# EAGLE schematic pcb (EAGLE 7.5.0)
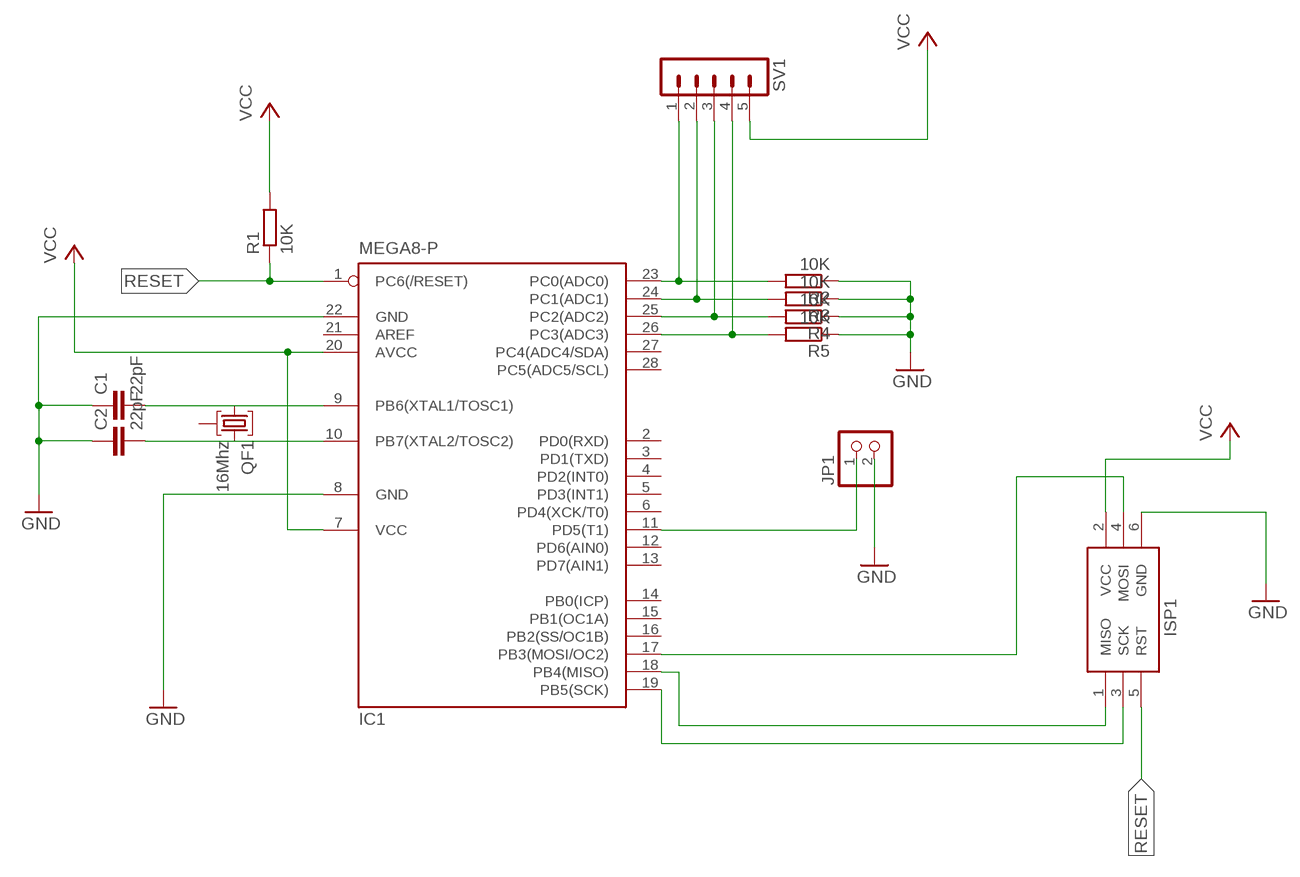
[diagram p0: schematic, sheet 1]

## Parts
C1  22pF  C-EU025-025X050  [C025-025X050]
C2  22pF  C-EU025-025X050  [C025-025X050]
IC1  MEGA8-P  [DIL28-3]
ISP1  AVRISP-6  [AVRISP]
JP1  PINHD-1X2  [1X02]
QF1  16Mhz  8M10AHC49T  [HC49U]
R1  10K  R-EU_0204/5  [0204/5]
R2  10K  R-EU_0204/5  [0204/5]
R3  10K  R-EU_0204/5  [0204/5]
R4  10K  R-EU_0204/5  [0204/5]
R5  10K  R-EU_0204/5  [0204/5]
SV1  MA05-1  [MA05-1]

## Nets
GND: C1.1 C2.1 IC1.8(GND) IC1.22(GND) ISP1.6(GND) JP1.2 R2.1 R3.1 R4.1 R5.1
N$2: IC1.26(PC3(ADC3)) R5.2 SV1.4
N$3: IC1.25(PC2(ADC2)) R4.2 SV1.3
N$4: IC1.24(PC1(ADC1)) R3.2 SV1.2
N$5: IC1.23(PC0(ADC0)) R2.2 SV1.1
N$6: IC1.11(PD5(T1)) JP1.1
N$7: IC1.19(PB5(SCK)) ISP1.3(SCK)
N$8: IC1.18(PB4(MISO)) ISP1.1(MISO)
N$9: IC1.17(PB3(MOSI/OC2)) ISP1.4(MOSI)
N$10: C1.2 IC1.9(PB6(XTAL1/TOSC1)) QF1.1
N$11: C2.2 IC1.10(PB7(XTAL2/TOSC2)) QF1.3
RESET: IC1.1(PC6(/RESET)) ISP1.5(RST) R1.1
VCC: IC1.7(VCC) IC1.20(AVCC) ISP1.2(VCC) R1.2 SV1.5
Unconnected: IC1.2(PD0(RXD)) IC1.3(PD1(TXD)) IC1.4(PD2(INT0)) IC1.5(PD3(INT1)) IC1.6(PD4(XCK/T0)) IC1.12(PD6(AIN0)) IC1.13(PD7(AIN1)) IC1.14(PB0(ICP)) IC1.15(PB1(OC1A)) IC1.16(PB2(SS/OC1B)) IC1.21(AREF) IC1.27(PC4(ADC4/SDA)) IC1.28(PC5(ADC5/SCL)) QF1.2

## Library data of the parts
C1 C2 = resistor:C-EU: CAPACITOR, European symbol
IC1 = atmel:MEGA8-P: MICROCONTROLLER 8 Kbytes FLASH, 1 kbytes SRAM, 512 bytes EEPROM, USART, 4-channel 10 bit ADC, 2-channel 8 bit ADC Pin compatible with Atmega48, ATMega88, ATMega168 Source: avr.lbr; OC_FARNELL: unknown; OC_NEWARK: unknown
ISP1 = adafruit:AVRISP: AVR ISP HEADER Standard 6 pin header for AVR programming
JP1 = pinhead:PINHD-1X2: PIN HEADER
QF1 = crystal:8M10AHC49T: Monolithic Crystal Filters Source: www.vanlong.com; OC_FARNELL: unknown; OC_NEWARK: unknown
R1-R5 = resistor:R-EU_: RESISTOR, European symbol
SV1 = con-lstb:MA05-1: PIN HEADER; OC_FARNELL: unknown; OC_NEWARK: unknown